# Altium project ATMEGA8精品开发板.PrjPCB
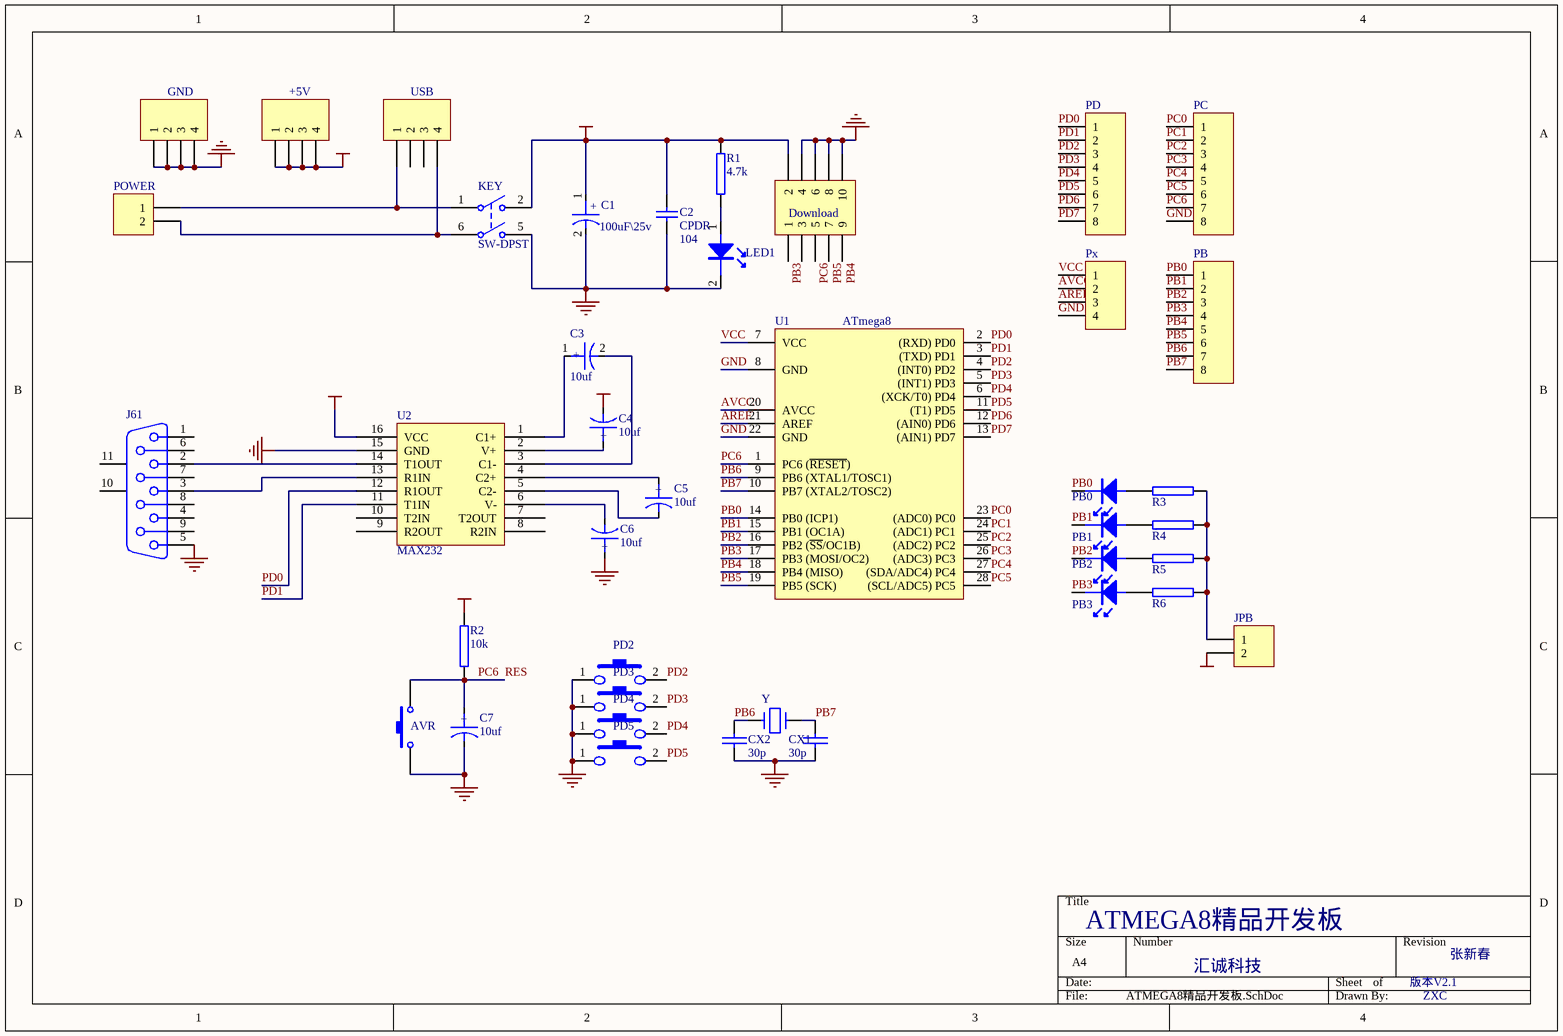
[diagram p0: ATMEGA8精品开发板.SchDoc]
1 sheet, 40 parts. Net scope: global (net labels, ports and power ports of the same name join across sheets).
Board file: ATMEGA8精品开发板.PcbDoc

## Sheet ATMEGA8精品开发板.SchDoc
size A4

### Parts
+5V  (no value)  [HDR1X4]
AVR  (no value)  [an-6*6]
C1  100uF\25v  [C-DJ-6]
C2  CPDR  value 104  [CPDR]
C3  10uf  [C-DJ-4]
C4  10uf  [C-DJ-4]
C5  10uf  [C-DJ-4]
C6  10uf  [C-DJ-4]
C7  10uf  [C-DJ-4]
CX1  30p  [HDR1X2]
CX2  30p  [HDR1X2]
GND  (no value)  [HDR1X4]
J61  D Connector 9  [DSUB1.385-2H9]  (value not drawn)
JPB  (no value)  [HDR1X2]
KEY  SW-DPST  [DPDT-6]
LED1  LED  [LED]  (value not drawn)
PB  (no value)  [HDR-8]
PB0  LED  [HDR1X2]  (value not drawn)
PB1  LED  [HDR1X2]  (value not drawn)
PB2  LED  [HDR1X2]  (value not drawn)
PB3  LED  [HDR1X2]  (value not drawn)
PC  (no value)  [HDR-8]
PD  (no value)  [HDR-8]
PD2  key1  [an-6*6]  (value not drawn)
PD3  key2  [an-6*6]  (value not drawn)
PD4  key3  [an-6*6]  (value not drawn)
PD5  key4  [an-6*6]  (value not drawn)
POWER  (no value)  [JK128]
Px  (no value)  [HDR-4]
R1  4.7k  [RSE]
R2  10k  [RSE]
R3  470  [RSE]  (value not drawn)
R4  470  [RSE]  (value not drawn)
R5  470  [RSE]  (value not drawn)
R6  470  [RSE]  (value not drawn)
U1  ATmega8  [底座DIP-28/引脚7.62mm]
U2  MAX232  [DIP16]
USB  (no value)  [USB-5V]
Y  Y  [JZ_ZC]
  Download  [HDR-2x5]

### Nets
GND: AVR.2 C1.2 C2.1 C6.1 C7.2 CX1.2 CX2.2 GND.1 GND.2 GND.3 GND.4 J61.5 KEY.5(NO2) LED1.2(K) PC.8 PD2.1 PD3.1 PD4.1 PD5.1 Px.4 U1.8(GND) U1.22(GND) U2.15(GND) .4 .6 .8 .10
VCC: +5V.1 +5V.2 +5V.3 +5V.4 C1.1 C2.2 C4.2 JPB.2 KEY.2(NO1) Px.1 R1.1 R2.2 U1.7(VCC) U2.16(VCC) .2
AREF: Px.3 U1.21(AREF)
AVCC: Px.2 U1.20(AVCC)
PB0: PB.1 PB0.2(K) U1.14(PB0_(ICP1))
PB1: PB.2 PB1.2(K) U1.15(PB1_(OC1A))
PB2: PB.3 PB2.2(K) U1.16(PB2_(~{SS}/OC1B))
PB3: PB.4 PB3.2(K) U1.17(PB3_(MOSI/OC2)) .1
PB4: PB.5 U1.18(PB4_(MISO)) .9
PB5: PB.6 U1.19(PB5_(SCK)) .7
PB6: CX2.1 PB.7 U1.9(PB6_(XTAL1/TOSC1)) Y.2
PB7: CX1.1 PB.8 U1.10(PB7_(XTAL2/TOSC2)) Y.1
PC0: PC.1 U1.23((ADC0)_PC0)
PC1: PC.2 U1.24((ADC1)_PC1)
PC2: PC.3 U1.25((ADC2)_PC2)
PC3: PC.4 U1.26((ADC3)_PC3)
PC4: PC.5 U1.27((SDA/ADC4)_PC4)
PC5: PC.6 U1.28((SCL/ADC5)_PC5)
PC6: AVR.1 C7.1 PC.7 R2.1 U1.1(PC6_(~{RESET})) .5  [also labelled RES]
PD0: PD.1 U1.2((RXD)_PD0) U2.12(R1OUT)
PD1: PD.2 U1.3((TXD)_PD1) U2.11(T1IN)
PD2: PD.3 PD2.2 U1.4((INT0)_PD2)
PD3: PD.4 PD3.2 U1.5((INT1)_PD3)
PD4: PD.5 PD4.2 U1.6((XCK/T0)_PD4)
PD5: PD.6 PD5.2 U1.11((T1)_PD5)
PD6: PD.7 U1.12((AIN0)_PD6)
PD7: PD.8 U1.13((AIN1)_PD7)
NetC3_1: C3.1 U2.1(C1+)
NetC3_2: C3.2 U2.3(C1-)
NetC4_1: C4.1 U2.2(V+)
NetC5_1: C5.1 U2.4(C2+)
NetC5_2: C5.2 U2.5(C2-)
NetC6_2: C6.2 U2.6(V-)
NetJ61_2: J61.2 U2.14(T1OUT)
NetJ61_3: J61.3 U2.13(R1IN)
NetJPB_1: JPB.1 R3.1 R4.1 R5.1 R6.1
NetKEY_1: KEY.1(COMMON1) POWER.1 USB.1
NetKEY_6: KEY.6(COMMON2) POWER.2 USB.4
NetLED1_1: LED1.1(A) R1.2
NetPB0_1: PB0.1(A) R3.2
NetPB1_1: PB1.1(A) R4.2
NetPB2_1: PB2.1(A) R5.2
NetPB3_1: PB3.1(A) R6.2

Not connected (* = marked no-connect by the designer): J61 1 4 6 7 8 9 10(MH1) 11(MH2); U2 7(T2OUT) 8(R2IN) 9(R2OUT) 10(T2IN); USB 2 3;  3

### Notes on the sheet
- ATMEGA8精品开发板
- 汇诚科技
- 版本V2.1
- 张新春
- ZXC
- (in symbol CAPACITOR POL) +

### Library data of the parts
+5V GND USB = Header 4: Header, 4-Pin; Revision: 17-Jul-2002: Re-released for DXP Platform.; Publisher: Altium Limited
AVR = SW-PB: Switch; Published: 24-Mar-1999; LatestRevisionDate: 17-Jul-2002; LatestRevisionNote: Re-released for DXP Platform.; Publisher: Altium Limited
C1 C3-C7 = CAPACITOR POL: Capacitor
C2 = CPDR: 瓷片电容; Published: 8-Jun-2000; LatestRevisionDate: 17-Jul-2002; LatestRevisionNote: Re-released for DXP Platform.; Publisher: Altium Limited
CX1 CX2 = CAP: Capacitor
J61 = D Connector 9: Receptacle Assembly, 9 Position, Right Angle; Package Information: Latest Revision: O; Positions: 9; Published: 15-Jun-2001; Revision: 17-Jul-2002: Re-released for DXP Platform.; Datasheet: (1-Sep-1999); Package Reference: 788750; Publisher: Altium Limited; Orientation: Right Angle; Gender: Receptacle
JPB POWER = Header 2: Header, 2-Pin; LatestRevisionDate: 17-Jul-2002; LatestRevisionNote: Re-released for DXP Platform.; Publisher: Altium Limited
KEY = SW-DPST: Double-Pole, Single-Throw Switch; Published: 24-Mar-1999; Revision: July-2002: Re-released for DXP Platform.; Publisher: Altium Limited
PB PC PD = PZ_8: 排针——8; LatestRevisionDate: 17-Jul-2002; LatestRevisionNote: Re-released for DXP Platform.; Publisher: Altium Limited
PD2-PD5 = key
Px = PZ_4: 排针——4; LatestRevisionDate: 17-Jul-2002; LatestRevisionNote: Re-released for DXP Platform.; Publisher: Altium Limited
R1-R6 = RES2
U1 = ATmega8-P: 8 位微处理器/28引脚; 子类别: 微处理器; 发布者: 磊元工作室; 发布日期: 2003年8月18日; 制造商: Atmel Corporation; 类别: 集成电路; 元件名称（国标）: 8 位微处理器; 元件名称（英文）: 8-bit Microcontroller; 特性:存储器容量: Flash：8KB ，EEPROM：512B ，RAM：1KB; 特性:定时器/计数器: 2 个 8-bit ，1 个 16-bit; 特性:模/数转换器: 6 通道 10-bit ADC; 特性:指令: 两个时钟周期的硬件乘法器
Y = CRYSTAL
 = Header 5X2: Header, 5-Pin, Dual row